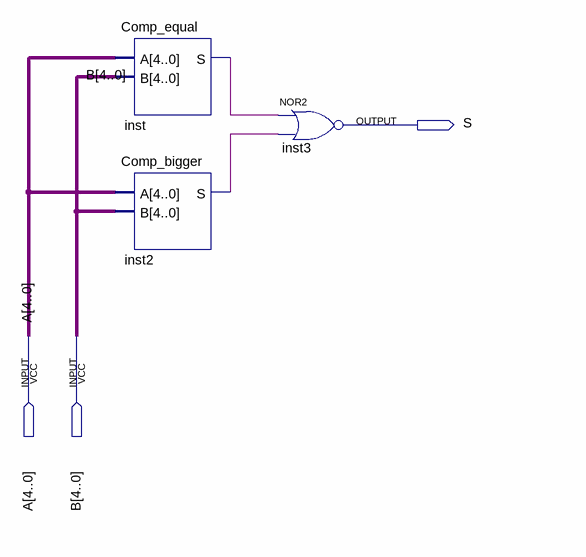
[diagram p0: schematic sheet]
// Quartus schematic Comp_smaller.bdf as structural Verilog: 3 symbols, 3 pins
module Comp_smaller (
  input  [4:0] A,
  input  [4:0] B,
  output S
);

  wire inst2_s, inst_s;

  Comp_equal inst (.A(A), .B(B), .S(inst_s));
  Comp_bigger inst2 (.A(A), .B(B), .S(inst2_s));
  nor inst3 (S, inst_s, inst2_s);
endmodule
